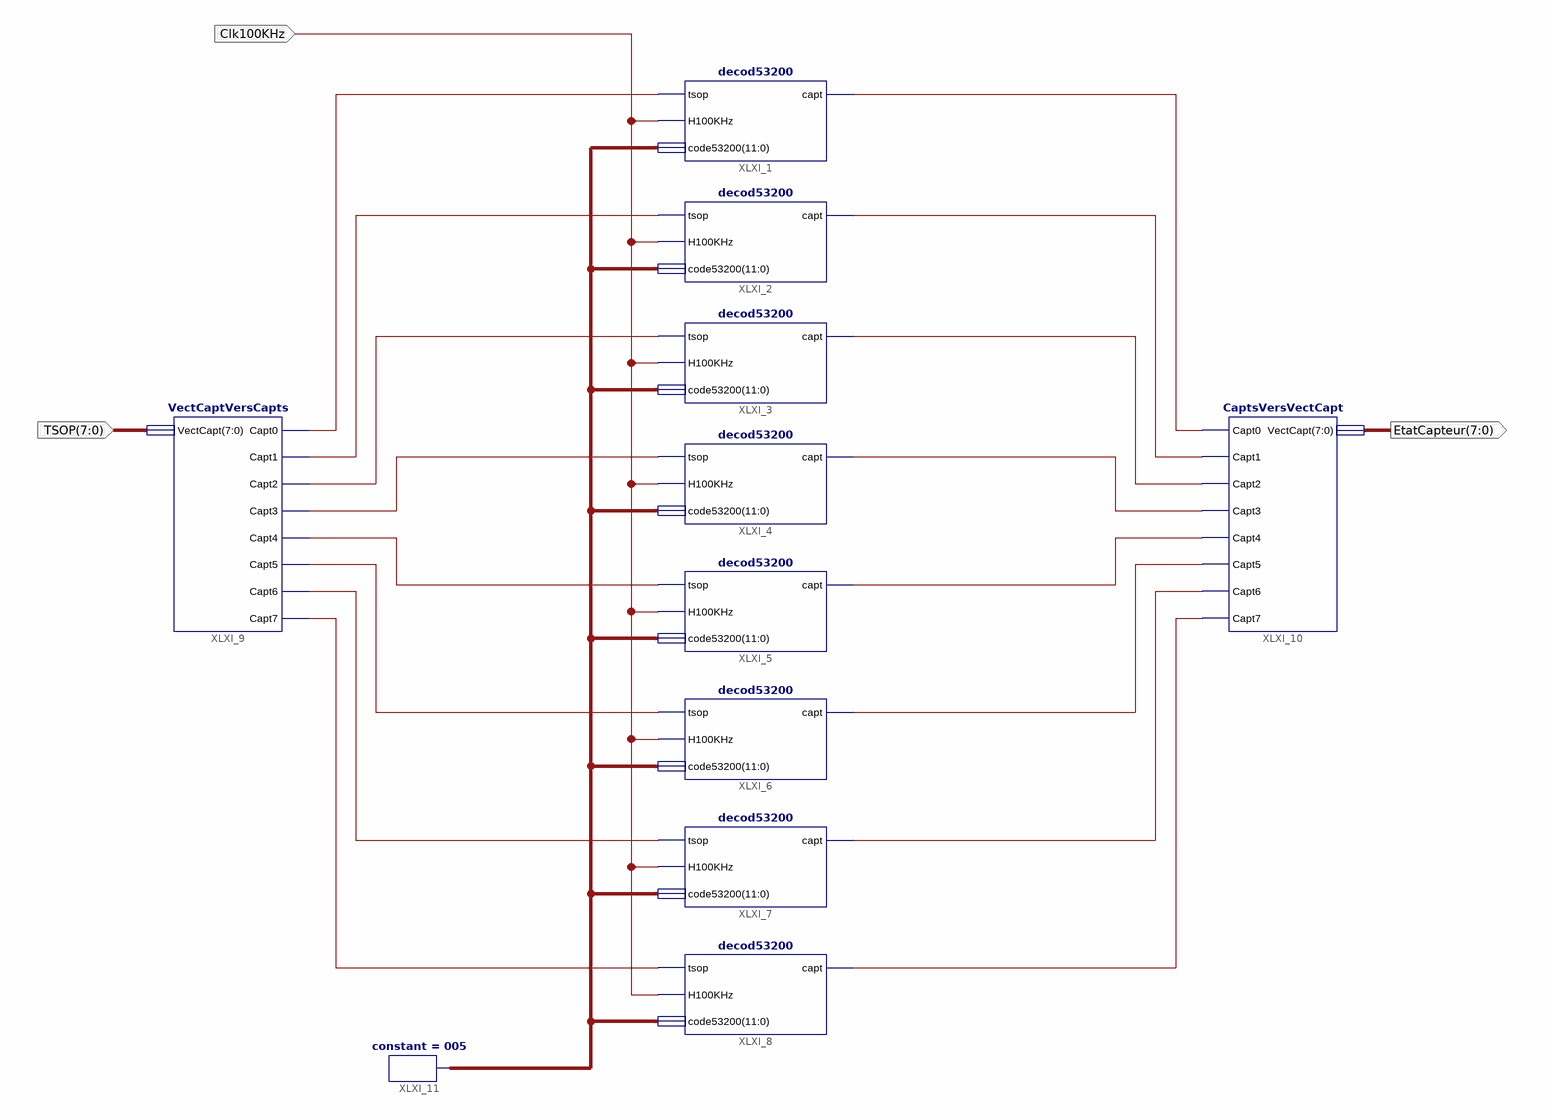
[diagram p0: schematic sheet 1]
// Xilinx ISE schematic decodeCapteurs.sch (spartan3a) as structural Verilog: 11 symbols, 3 ports
module decodeCapteurs (
  input  [7:0] TSOP,
  input  Clk100KHz,
  output [7:0] EtatCapteur
);

  wire XLXN_1, XLXN_2, XLXN_3, XLXN_4, XLXN_5, XLXN_6, XLXN_7, XLXN_8, XLXN_31, XLXN_32, XLXN_33, XLXN_34,
       XLXN_35, XLXN_36, XLXN_37, XLXN_38;
  wire [11:0] XLXN_15;

  decod53200 XLXI_1 (.tsop(XLXN_1), .H100KHz(Clk100KHz), .code53200(XLXN_15), .capt(XLXN_31));
  decod53200 XLXI_2 (.tsop(XLXN_2), .H100KHz(Clk100KHz), .code53200(XLXN_15), .capt(XLXN_32));
  decod53200 XLXI_3 (.tsop(XLXN_3), .H100KHz(Clk100KHz), .code53200(XLXN_15), .capt(XLXN_33));
  decod53200 XLXI_4 (.tsop(XLXN_4), .H100KHz(Clk100KHz), .code53200(XLXN_15), .capt(XLXN_34));
  decod53200 XLXI_5 (.tsop(XLXN_5), .H100KHz(Clk100KHz), .code53200(XLXN_15), .capt(XLXN_35));
  decod53200 XLXI_6 (.tsop(XLXN_6), .H100KHz(Clk100KHz), .code53200(XLXN_15), .capt(XLXN_36));
  decod53200 XLXI_8 (.tsop(XLXN_8), .H100KHz(Clk100KHz), .code53200(XLXN_15), .capt(XLXN_38));
  decod53200 XLXI_7 (.tsop(XLXN_7), .H100KHz(Clk100KHz), .code53200(XLXN_15), .capt(XLXN_37));
  VectCaptVersCapts XLXI_9 (
    .VectCapt(TSOP), .Capt0(XLXN_1), .Capt1(XLXN_2), .Capt2(XLXN_3), .Capt3(XLXN_4), .Capt4(XLXN_5),
    .Capt5(XLXN_6), .Capt6(XLXN_7), .Capt7(XLXN_8));
  constant #(.CValue("005")) XLXI_11 (.O(XLXN_15));
  CaptsVersVectCapt XLXI_10 (
    .Capt0(XLXN_31), .Capt1(XLXN_32), .Capt2(XLXN_33), .Capt3(XLXN_34), .VectCapt(EtatCapteur),
    .Capt4(XLXN_35), .Capt5(XLXN_36), .Capt6(XLXN_37), .Capt7(XLXN_38));
endmodule
